# Altium schematic sheet Э3-5 TDR Генератор.SchDoc
size 594 x 420 mm; Address1: Address1; Address2: Address2; Address3: Address3; Address4: Address4; DocumentNumber: АБВГ.123456.001 Э3; SheetNumber: 6; SheetTotal: 7; Scale: 1:1; DocumentType: Схема электрическая принципиальная; FirstReferrence: АБВГ.123456.001
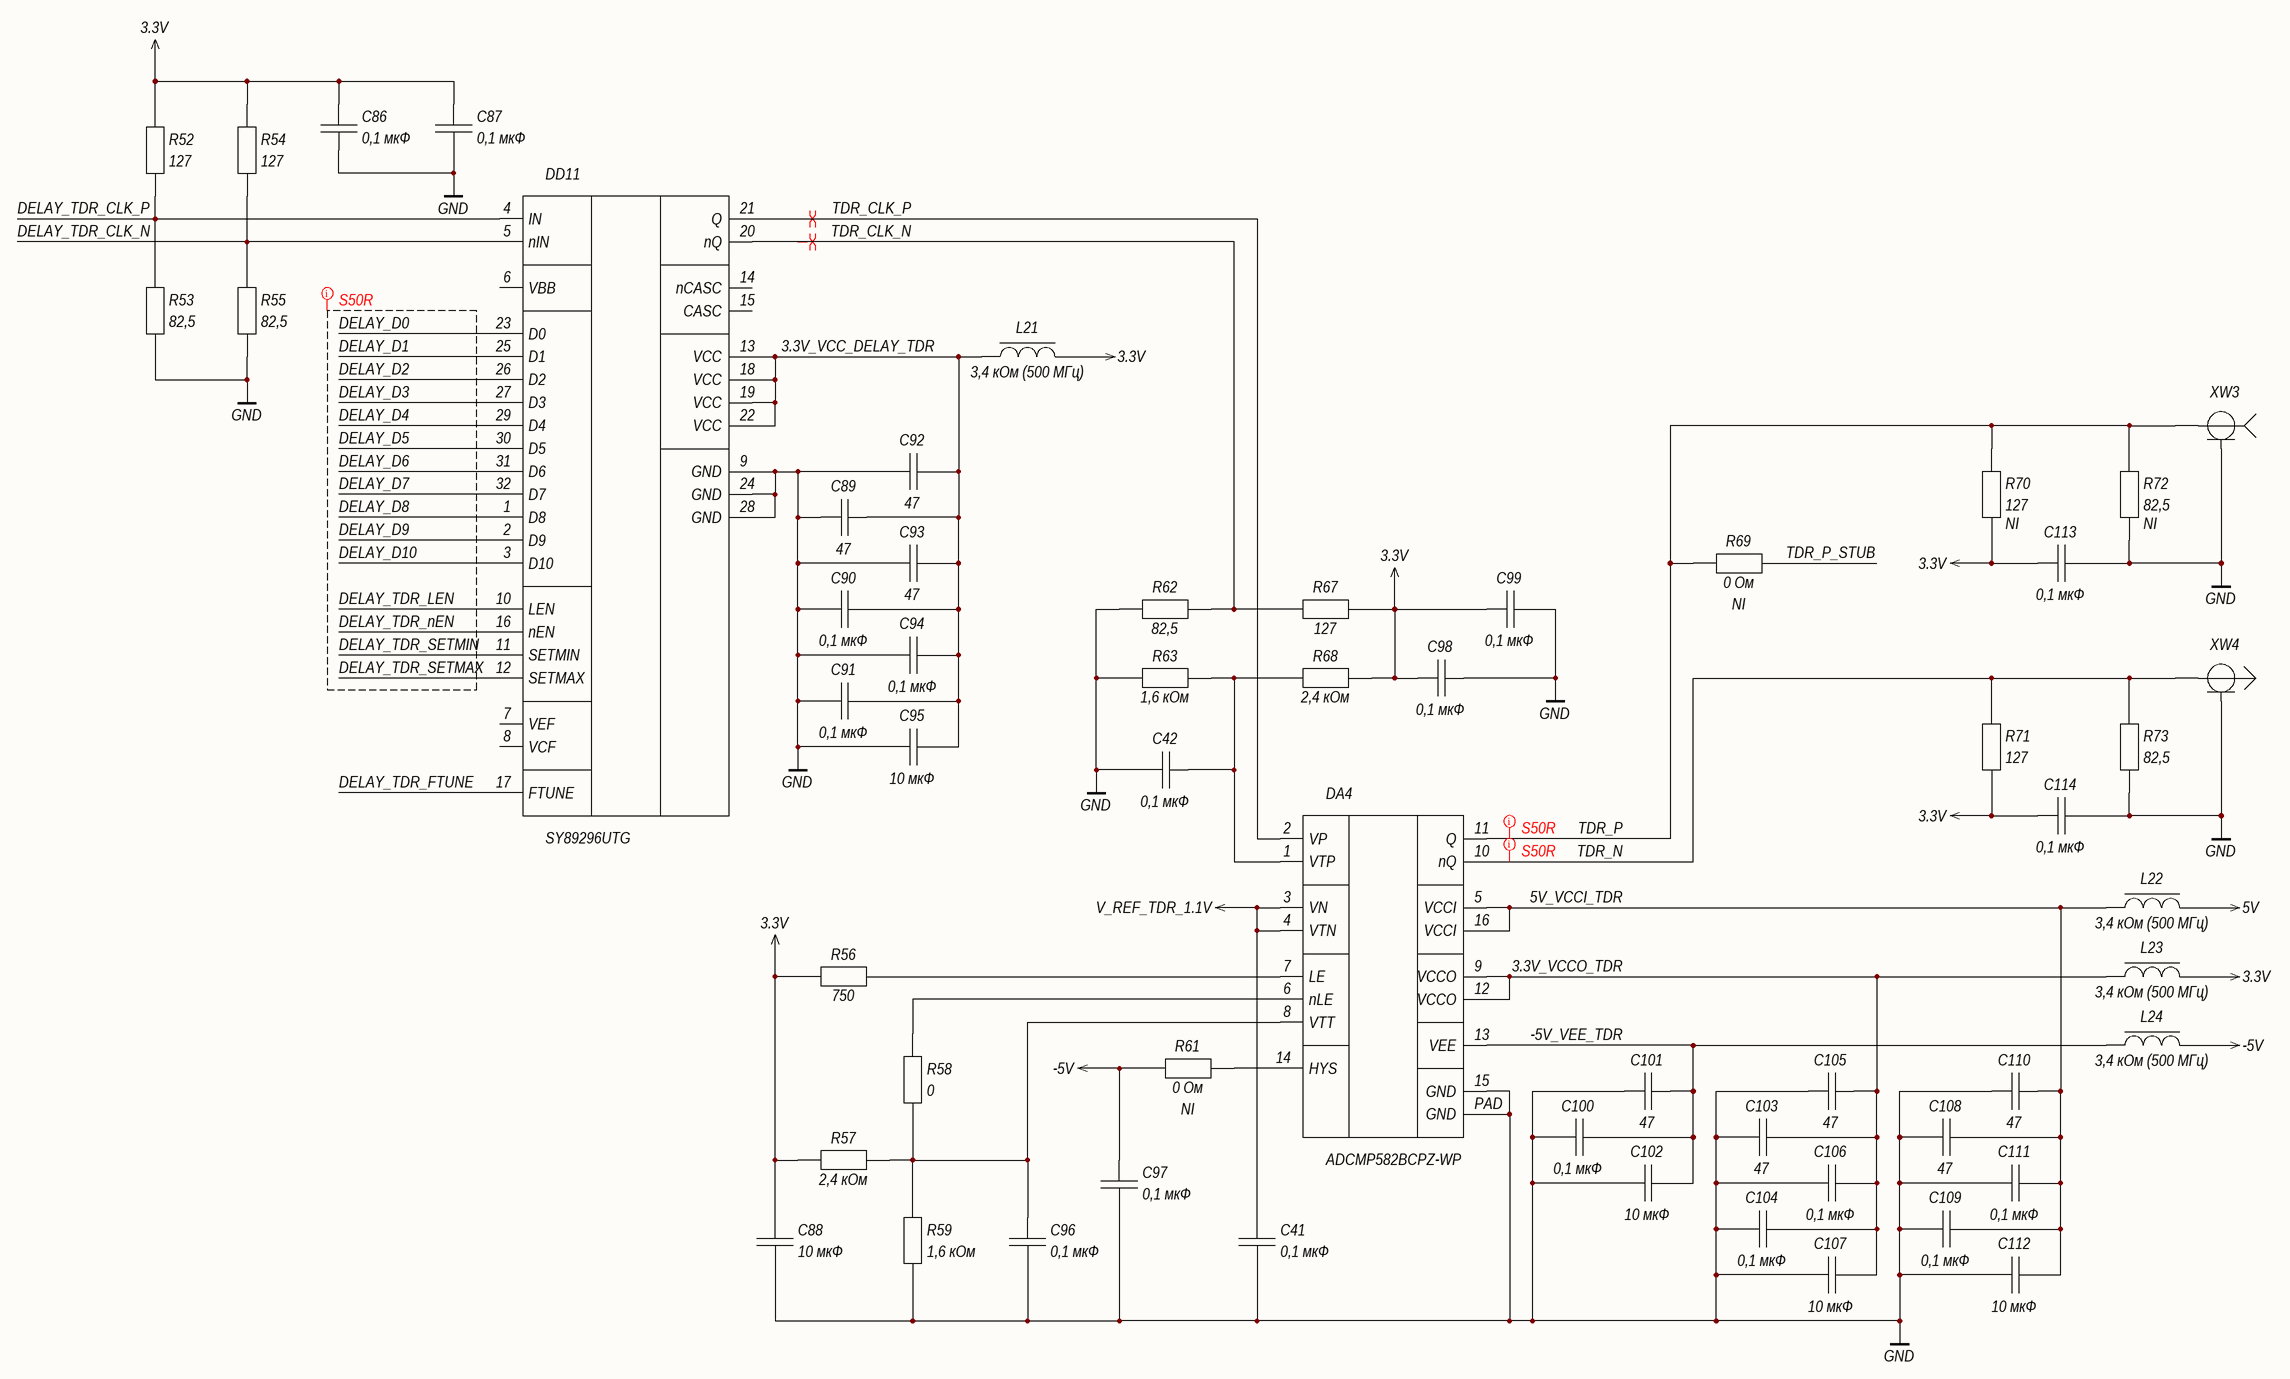
[diagram p0: Э3-5 TDR Генератор.SchDoc]

## Parts
C41  value 0,1 мкФ  [C0402-B-0.5mm]
C42  value 0,1 мкФ  [C0402-B-0.5mm]
C86  value 0,1 мкФ  [C0402-B-0.5mm]
C87  value 0,1 мкФ  [C0402-B-0.5mm]
C88  value 10 мкФ  [C0603-B-0.8mm]
C89  value 47  [C0402-B-0.5mm]
C90  value 0,1 мкФ  [C0402-B-0.5mm]
C91  value 0,1 мкФ  [C0402-B-0.5mm]
C92  value 47  [C0402-B-0.5mm]
C93  value 47  [C0402-B-0.5mm]
C94  value 0,1 мкФ  [C0402-B-0.5mm]
C95  value 10 мкФ  [C0603-B-0.8mm]
C96  value 0,1 мкФ  [C0402-B-0.5mm]
C97  value 0,1 мкФ  [C0402-B-0.5mm]
C98  value 0,1 мкФ  [C0402-B-0.5mm]
C99  value 0,1 мкФ  [C0402-B-0.5mm]
C100  value 0,1 мкФ  [C0402-B-0.5mm]
C101  value 47  [C0402-B-0.5mm]
C102  value 10 мкФ  [C0603-B-0.8mm]
C103  value 47  [C0402-B-0.5mm]
C104  value 0,1 мкФ  [C0402-B-0.5mm]
C105  value 47  [C0402-B-0.5mm]
C106  value 0,1 мкФ  [C0402-B-0.5mm]
C107  value 10 мкФ  [C0603-B-0.8mm]
C108  value 47  [C0402-B-0.5mm]
C109  value 0,1 мкФ  [C0402-B-0.5mm]
C110  value 47  [C0402-B-0.5mm]
C111  value 0,1 мкФ  [C0402-B-0.5mm]
C112  value 10 мкФ  [C0603-B-0.8mm]
C113  value 0,1 мкФ  [C0402-B-0.5mm]
C114  value 0,1 мкФ  [C0402-B-0.5mm]
DA4  ADCMP582BCPZ-WP  [16-LFCSP-3-H0.75]
DD11  SY89296UTG  [32-TQFP-B]
L21  value 3,4 кОм (500 МГц)  [L0402-B-0.5mm]
L22  value 3,4 кОм (500 МГц)  [L0402-B-0.5mm]
L23  value 3,4 кОм (500 МГц)  [L0402-B-0.5mm]
L24  value 3,4 кОм (500 МГц)  [L0402-B-0.5mm]
R52  value 127  [CR0402-B-0.35mm]
R53  value 82,5  [CR0402-B-0.35mm]
R54  value 127  [CR0402-B-0.35mm]
R55  value 82,5  [CR0402-B-0.35mm]
R56  value 750  [CR0402-B-0.35mm]
R57  value 2,4 кОм  [CR0402-B-0.35mm]
R58  value 0  [CR0402-B-0.35mm]
R59  value 1,6 кОм  [CR0402-B-0.35mm]
R61  value 0 Ом  ComponentType: NI  [CR0402-B-0.35mm]
R62  value 82,5  [CR0402-B-0.35mm]
R63  value 1,6 кОм  [CR0402-B-0.35mm]
R67  value 127  [CR0402-B-0.35mm]
R68  value 2,4 кОм  [CR0402-B-0.35mm]
R69  value 0 Ом  ComponentType: NI  [CR0402-B-0.35mm]
R70  value 127  ComponentType: NI  [CR0402-B-0.35mm]
R71  value 127  [CR0402-B-0.35mm]
R72  value 82,5  ComponentType: NI  [CR0402-B-0.35mm]
R73  value 82,5  [CR0402-B-0.35mm]
XW3  XW(S)  [SMA-J-P-H-ST-EM1]  (value not drawn)
XW4  XW(P)  [U.FL STR PLG]  (value not drawn)

## Nets
3.3V: C86.1 C87.1 C88.1 C98.1 C99.1 C113.1 C114.1 L21.2 L23.2 R52.1 R54.1 R56.1 R57.1 R67.2 R68.2 R70.2 R71.2
5V: L22.2
-5V: C97.1 L24.2 R61.1
GND: C41.2 C42.1 C86.2 C87.2 C88.2 C89.1 C90.1 C91.1 C92.1 C93.1 C94.1 C95.1 C96.2 C97.2 C98.2 C99.2 C100.1 C101.1 C102.1 C103.1 C104.1 C105.1 C106.1 C107.1 C108.1 C109.1 C110.1 C111.1 C112.1 C113.2 C114.2 DA4.15(GND) DA4.PAD(GND) DD11.9(GND) DD11.24(GND) DD11.28(GND) R53.2 R55.2 R59.2 R62.1 R63.1 R72.2 R73.2 XW3.2 XW4.2
V_REF_TDR_1.1V: C41.1 DA4.3(VN) DA4.4(VTN)
3.3V_VCC_DELAY_TDR: C89.2 C90.2 C91.2 C92.2 C93.2 C94.2 C95.2 DD11.13(VCC) DD11.18(VCC) DD11.19(VCC) DD11.22(VCC) L21.1
3.3V_VCCO_TDR: C103.2 C104.2 C105.2 C106.2 C107.2 DA4.9(VCCO) DA4.12(VCCO) L23.1
5V_VCCI_TDR: C108.2 C109.2 C110.2 C111.2 C112.2 DA4.5(VCCI) DA4.16(VCCI) L22.1
-5V_VEE_TDR: C100.2 C101.2 C102.2 DA4.13(VEE) L24.1
DELAY_D0: DD11.23(D0)
DELAY_D1: DD11.25(D1)
DELAY_D2: DD11.26(D2)
DELAY_D3: DD11.27(D3)
DELAY_D4: DD11.29(D4)
DELAY_D5: DD11.30(D5)
DELAY_D6: DD11.31(D6)
DELAY_D7: DD11.32(D7)
DELAY_D8: DD11.1(D8)
DELAY_D9: DD11.2(D9)
DELAY_D10: DD11.3(D10)
DELAY_TDR_CLK_N: DD11.5(nIN) R54.2 R55.1
DELAY_TDR_CLK_P: DD11.4(IN) R52.2 R53.1
DELAY_TDR_FTUNE: DD11.17(FTUNE)
DELAY_TDR_LEN: DD11.10(LEN)
DELAY_TDR_nEN: DD11.16(nEN)
DELAY_TDR_SETMAX: DD11.12(SETMAX)
DELAY_TDR_SETMIN: DD11.11(SETMIN)
TDR_CLK_N: DD11.20(nQ) R62.2 R67.1
TDR_CLK_P: DA4.2(VP) DD11.21(Q)
TDR_N: DA4.10(nQ) R71.1 R73.1 XW4.1
TDR_P: DA4.11(Q) R69.1 R70.1 R72.1 XW3.1
TDR_P_STUB: R69.2
NetC42_2: C42.2 DA4.1(VTP) R63.2 R68.1
NetC96_1: C96.1 DA4.8(VTT) R57.2 R58.2 R59.1
NetDA4_6: DA4.6(nLE) R58.1
NetDA4_7: DA4.7(LE) R56.2
NetDA4_14: DA4.14(HYS) R61.2

Not connected (* = marked no-connect by the designer): DD11 6(VBB) 7(VEF) 8(VCF) 14(nCASC) 15(CASC)

## Layout directives
differential pair: TDR_CLK_N, TDR_CLK_P
net class S50R: DELAY_D0, DELAY_D1, DELAY_D2, DELAY_D3, DELAY_D4, DELAY_D5, DELAY_D6, DELAY_D7, DELAY_D8, DELAY_D9, DELAY_D10, DELAY_TDR_LEN, DELAY_TDR_nEN, DELAY_TDR_SETMAX, DELAY_TDR_SETMIN, TDR_N, TDR_P

## Notes on the sheet
- Перв. примен.
- Справ. №
- Подп. и дата
- Инв. № дубл.
- Взам. инв. №
- Инв. № подл.
- Изм.
- Лист
- № докум.
- Подп.
- Дата
- 2.106-A2
- Копировал
- Формат А2

## Library data of the parts
C41 C86 C87 C96 C97 = Non Polar Ver.: 0402 X7R 0,1 мкФ ±10 % 50 В; PartNumber: GRM155R71H104KE14D; TemperatureRange: -XX...+XX°C; VoltageRating: 50 В; Manufacturer: *; Package: *; HelpURL: *; Tolerance: *; TypeDielectric: *; ESR: *; ComponentType: CAP
C42 C90 C91 C94 C98-C100 C104 C106 C109 C111 C113 C114 = Non Polar Hor.: 0402 X7R 0,1 мкФ ±10 % 50 В; PartNumber: GRM155R71H104KE14D; TemperatureRange: -XX...+XX°C; VoltageRating: 50 В; Manufacturer: *; Package: *; HelpURL: *; Tolerance: *; TypeDielectric: *; ESR: *; ComponentType: CAP
C88 = Non Polar Ver.: 0603 X5R 10 мкФ ±20 % 25 В; PartNumber: GRM188R61E106MA73; TemperatureRange: -XX...+XX°C; VoltageRating: 25 В; Manufacturer: *; Package: *; HelpURL: *; Tolerance: *; TypeDielectric: *; ESR: *; ComponentType: CAP
C89 C92 C93 C101 C103 C105 C108 C110 = Non Polar Hor.: 0402 NP0 47 пФ ±5 % 50 В; PartNumber: GCM1555C1H470JA16; TemperatureRange: -XX...+XX°C; VoltageRating: 50 В; Manufacturer: *; Package: *; HelpURL: *; Tolerance: *; TypeDielectric: *; ESR: *; ComponentType: CAP
C95 C102 C107 C112 = Non Polar Hor.: 0603 X5R 10 мкФ ±20 % 25 В; PartNumber: GRM188R61E106MA73; TemperatureRange: -XX...+XX°C; VoltageRating: 25 В; Manufacturer: *; Package: *; HelpURL: *; Tolerance: *; TypeDielectric: *; ESR: *; ComponentType: CAP
DA4 = ADCMP582: Ultrafast SiGe Voltage Comparators; Manufacturer: Analog Devices, Inc.; TemperatureRange: -40...+125°C; Package: 16-LFCSP; PartNumber: ADCMP582BCPZ-WP; ComponentType: IC; DatasheetURL: *; HelpURL: *; PinCount: 16
DD11 = SY89296UTG: 2.5V/3.3V, 1.5 GHz, LVPECL Programmable Delay with Fine Tune Control; Manufacturer: Microchip; TemperatureRange: -40...+85°C; Package: 32-TQFP; DatasheetURL: *; HelpURL: *; PinCount: 32; PartNumber: SY89296UTG; ComponentType: IC
L21-L24 = Inductor MC Hor.: PartNumber: BLM15HD182BH1; TemperatureRange: -XX...+XX°C; Manufacturer: *; Package: *; HelpURL: *; MaxCurrent: *; ComponentType: IND; DatasheetURL: *; PinCount: 2
R52 R54 R70 R71 = Resistor Ver.: 0402 127 Ом ±1 %; TemperatureRange: -XX...+XX°C; Manufacturer: *; PartNumber: *; Package: *; HelpURL: *; PowerRating: *; DatasheetURL: *; Tolerance: *
  R52 R54 R71: ComponentType: RES
R53 R55 R72 R73 = Resistor Ver.: 0402 82,5 Ом ±1 %; TemperatureRange: -XX...+XX°C; Manufacturer: *; PartNumber: *; Package: *; HelpURL: *; PowerRating: *; DatasheetURL: *; Tolerance: *
  R53 R55 R73: ComponentType: RES
R56 = Resistor Hor.: 0402 750 Ом ±5 %; TemperatureRange: -XX...+XX°C; Manufacturer: *; PartNumber: *; Package: *; HelpURL: *; PowerRating: *; Tolerance: *; DatasheetURL: *; ComponentType: RES
R57 R68 = Resistor Hor.: 0402 2,4 кОм ±1 %; TemperatureRange: -XX...+XX°C; Manufacturer: *; PartNumber: *; Package: *; HelpURL: *; PowerRating: *; Tolerance: *; DatasheetURL: *; ComponentType: RES
R58 = Resistor Ver.: 0402 0 Ом; TemperatureRange: -XX...+XX°C; Manufacturer: *; PartNumber: *; Package: *; HelpURL: *; PowerRating: *; DatasheetURL: *; Tolerance: *; ComponentType: RES
R59 = Resistor Ver.: 0402 1,6 кОм ±1 %; TemperatureRange: -XX...+XX°C; Manufacturer: *; PartNumber: *; Package: *; HelpURL: *; PowerRating: *; DatasheetURL: *; Tolerance: *; ComponentType: RES
R61 R69 = Resistor Hor.: 0402 0 Ом; TemperatureRange: -XX...+XX°C; Manufacturer: *; PartNumber: *; Package: *; HelpURL: *; PowerRating: *; Tolerance: *; DatasheetURL: *
R62 = Resistor Hor.: 0402 82,5 Ом ±1 %; TemperatureRange: -XX...+XX°C; Manufacturer: *; PartNumber: *; Package: *; HelpURL: *; PowerRating: *; Tolerance: *; DatasheetURL: *; ComponentType: RES
R63 = Resistor Hor.: 0402 1,6 кОм ±1 %; TemperatureRange: -XX...+XX°C; Manufacturer: *; PartNumber: *; Package: *; HelpURL: *; PowerRating: *; Tolerance: *; DatasheetURL: *; ComponentType: RES
R67 = Resistor Hor.: 0402 127 Ом ±1 %; TemperatureRange: -XX...+XX°C; Manufacturer: *; PartNumber: *; Package: *; HelpURL: *; PowerRating: *; Tolerance: *; DatasheetURL: *; ComponentType: RES
XW3 = XW(S): TemperatureRange: -XX...+XX°C; Manufacturer: *; Package: *; HelpURL: *; DatasheetURL: *; PartNumber: *; PinCount: 2; ComponentType: Connector
XW4 = XW(P): TemperatureRange: -XX...+XX°C; Manufacturer: *; Package: *; HelpURL: *; DatasheetURL: *; PartNumber: *; PinCount: 2; ComponentType: Connector